# Altium project edison_breakout.PrjPcb (part 2 of 2)

## Sheet usb_uart.SchDoc: Edison Gateway - Serial
size Letter; Author: Ye-Sheng Kuo; DocumentNumber: 7; Revision: 3; SheetNumber: 7; SheetTotal: 10
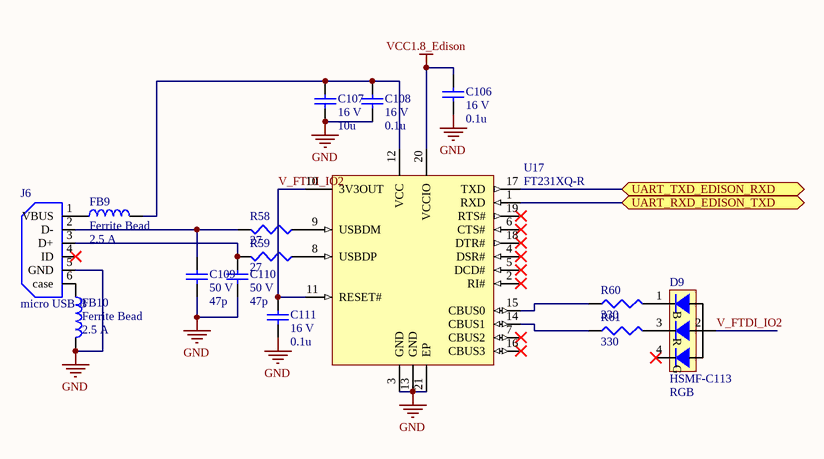
[diagram p7: usb_uart.SchDoc]

### Parts
C106  voltage rated: 16 V  [0402]  (hidden comment: 0.1u)
C107  voltage rated: 16 V  [0603]  (hidden comment: 10u)
C108  voltage rated: 16 V  [0402]  (hidden comment: 0.1u)
C109  voltage rated: 50 V  [0402]  (hidden comment: 47p)
C110  voltage rated: 50 V  [0402]  (hidden comment: 47p)
C111  voltage rated: 16 V  [0402]  (hidden comment: 0.1u)
D9  HSMF-C113  value RGB  [HSMF]
FB9  Ferrite Bead  Current Rating (Max): 2.5 A  [0603]
FB10  Ferrite Bead  Current Rating (Max): 2.5 A  [0603]
J6  micro USB-B  [Micro USB-B]
R58  27  [0402]
R59  27  [0402]
R60  330  [0402]
R61  330  [0402]
U17  FT231XQ-R  [QFN-20_N]

### Ports
UART_RXD_EDISON_TXD, UART_TXD_EDISON_RXD

### Nets
GND: C106.2 C107.2 C108.2 C109.2 C110.2 C111.2 FB10.1 J6.5(GND) U17.3(GND) U17.13(GND) U17.21(EP)
VCC1.8_Edison: C106.1 U17.20(VCCIO)
Edison_Serial_RX: U17.17(TXD) ; port UART_TXD_EDISON_RXD
Edison_Serial_TX: U17.1(RXD) ; port UART_RXD_EDISON_TXD
V_FTDI_IO2: C111.1 D9.2 U17.10(3V3OUT) U17.11(RESET#)
NetC107_1: C107.1 C108.1 FB9.1 U17.12(VCC)
NetC109_1: C109.1 J6.2(D-) R58.1
NetC110_1: C110.1 J6.3(D+) R59.1
NetD9_1: D9.1 R60.1
NetD9_3: D9.3 R61.1
NetFB9_2: FB9.2 J6.1(VBUS)
NetFB10_2: FB10.2 J6.6(case)
NetR58_2: R58.2 U17.9(USBDM)
NetR59_2: R59.2 U17.8(USBDP)
NetR60_2: R60.2 U17.15(CBUS0)
NetR61_2: R61.2 U17.14(CBUS1)

Not connected (* = marked no-connect by the designer): D9 4*; J6 4(ID)*; U17 2(RI#)* 4(DSR#)* 5(DCD#)* 6(CTS#)* 7(CBUS2)* 16(CBUS3)* 18(DTR#)* 19(RTS#)*

### Notes on the sheet
- Title
- Date:
- Author:
- Revision:
- Sheet
- of
- University of Michigan
- File:
- (in symbol HSMF-C113) B; R; G

### Library data of the parts
C106 C108 C111 = GRM155R71C104KA88D: 0.10µF ±10% 16V Ceramic Capacitor X7R 0402; Manufacture: Murata; tolerance: 10%; package: 0402; Supplier 1: Digi-Key; Supplier Part Number 1: 490-3261-1-ND; Value: 0.1u; Temperature Coefficient: X7R; Manufacturer Part Number: GRM155R71C104KA88D
C107 = GRM188C81C106MA73D: 10µF ±20% 16V Ceramic Capacitor X6S 0603; Manufacture: Murata; tolerance: 20%; package: 0603; Temperature Coefficient: X6S; Supplier 1: Digi-Key; Supplier Part Number 1: 490-7198-1-ND; Value: 10u; Manufacturer Part Number: GRM188C81C106MA73D
C109 C110 = 500R07N470JV4T: 47pF ±5% 50V Ceramic Capacitor C0G, NP0 0402; Manufacture: Johanson Dielectrics Inc.; tolerance: 5%; package: 0402; Supplier 1: Digi-Key; Supplier Part Number 1: 709-1121-1-ND; Value: 47p; Temperature Coefficient: C0G, NP0; Manufacturer Part Number: 500R07N470JV4T
D9 = HSMF-C113: Red, Green, Blue (RGB) 626nm Red, 572nm Green, 470nm Blue LED Indication - Discrete 1.9V Red, 2V Green, 3.4V Blue 4-SMD; Manufacturer: Broadcom Limited; Supplier 1: Digi-Key; Supplier Part Number 1: 516-2232-1-ND; Manufacturer Part Number: HSMF-C113; Wavelength: 626nm Red, 572nm Green, 470nm Blue
FB9 FB10 = BLM18SG221TN1D: FERRITE BEAD 220 OHM 0603; Manufacturer: Murata; DC resistance: 40m; Impedance @ Frequency: 220 Ohm @ 100MHz; package: 0603; Supplier 1: Digi-Key; Supplier Part Number 1: 490-5225-1-ND; Manufacturer Part Number: BLM18SG221TN1D
J6 = Micro USB: CONN USB MICRO B RECPT SMT R/A; Supplier 1: Digi-Key; Supplier Part Number 1: 609-4616-1-ND
R58 R59 = CRCW040227R0FKED: RES SMD 27 OHM 1% 1/16W 0402; Manufacturer: Vishay Dale; Temperature Coefficient: 100 ppm/C; Tolerance: 1%; Power: 1/16 W; package: 0402; Supplier 1: Digi-Key; Supplier Part Number 1: 541-27.0LCT-ND; value: 27; Manufacturer Part Number: CRCW040227R0FKED
R60 R61 = CRCW0402330RFKED: RES SMD 330 OHM 1% 1/16W 0402; Manufacturer: Vishay Dale; Temperature Coefficient: 100 ppm/C; Tolerance: 1%; Power: 1/16 W; package: 0402; Supplier 1: Digi-Key; Supplier Part Number 1: 541-330LCT-ND; value: 330; Manufacturer Part Number: CRCW0402330RFKED
U17 = FT231XQ-R: USB to Full-Handshake UART Interface Chip, UHCI/OHCI/EHCI Compatible, USB 2.0 Compatible, -40 to +85 degC, 20-Pin QFN, Pb-Free, Tape and Reel; Manufacturer: FTDI; DatasheetVersion: ver 1.2, Feb-2013; PackageVersion: Feb-13; PackageReference: QFN-20; PackageDescription: 20-Pin Quad Flat No-Lead, 4 x 4 mm Body, 0.5 mm Pitch; Code_JEDEC: MO-220WGGD-1; PartNumber: FT231XQ-R; ComponentLink1Description: Manufacturer URL; ComponentLink1URL: http://www.ftdichip.com/; ComponentLink2Description: Datasheet; ComponentLink2URL: http://www.ftdichip.com/Support/Documents/DataSheets/ICs/DS_FT231X.pdf; ComponentLink3Description: FT231X Product Page; ComponentLink3URL: www.ftdichip.com/Products/ICs/FT231X.html; Supplier 1: Digi-Key; Supplier Part Number 1: 768-1155-ND

## Sheet cc2520_cc2592.SchDoc: Edison Gateway - CC2520
size Letter; Author: Ye-Sheng Kuo; DocumentNumber: 9; Revision: 3; SheetNumber: 9; SheetTotal: 10
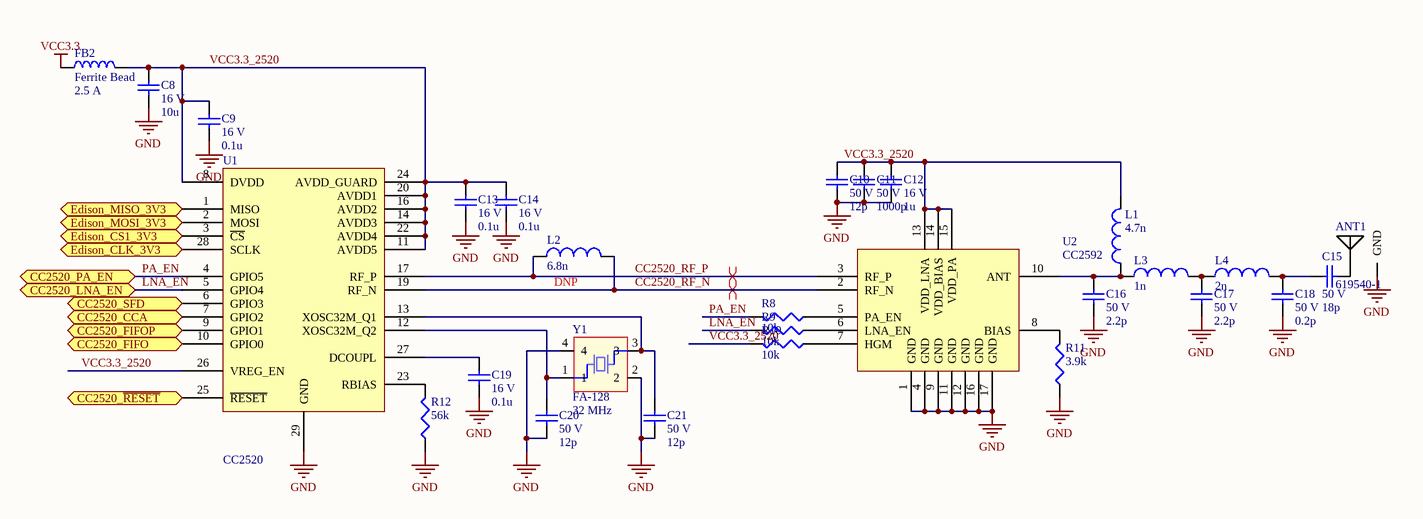
[diagram p8: cc2520_cc2592.SchDoc]

### Parts
ANT1  619540-1  [619540-1]
C8  voltage rated: 16 V  [0603]  (hidden comment: 10u)
C9  voltage rated: 16 V  [0402]  (hidden comment: 0.1u)
C10  voltage rated: 50 V  [0402]  (hidden comment: 12p)
C11  voltage rated: 50 V  [0402]  (hidden comment: 1000p)
C12  voltage rated: 16 V  [0402]  (hidden comment: 1u)
C13  voltage rated: 16 V  [0402]  (hidden comment: 0.1u)
C14  voltage rated: 16 V  [0402]  (hidden comment: 0.1u)
C15  voltage rated: 50 V  [0402]  (hidden comment: 18p)
C16  voltage rated: 50 V  [0402]  (hidden comment: 2.2p)
C17  voltage rated: 50 V  [0402]  (hidden comment: 2.2p)
C18  voltage rated: 50 V  [0402]  (hidden comment: 0.2p)
C19  voltage rated: 16 V  [0402]  (hidden comment: 0.1u)
C20  voltage rated: 50 V  [0402]  (hidden comment: 12p)
C21  voltage rated: 50 V  [0402]  (hidden comment: 12p)
FB2  Ferrite Bead  Current Rating (Max): 2.5 A  [0603]
L1  4.7n  [0402]
L2  Note: DNP  [0402]  (hidden comment: 6.8n)
L3  1n  [0402]
L4  2n  [0402]
R8  10k  [0402]
R9  10k  [0402]
R10  10k  [0402]
R11  3.9k  [0402]
R12  56k  [0402]
U1  CC2520  [QFN-28]
U2  CC2592  [QFN-16]
Y1  FA-128  frequency: 32 MHz  [FA-128]

### Ports
CC2520_CCA, CC2520_FIFO, CC2520_FIFOP, CC2520_LNA_EN, CC2520_PA_EN, CC2520_SFD, CC2520_~{RESET}, Edison_CLK_3V3, Edison_CS1_3V3, Edison_MISO_3V3, Edison_MOSI_3V3

### Nets
GND: ANT1.1(GND) C8.2 C9.2 C10.2 C11.2 C12.2 C13.2 C14.2 C16.2 C17.2 C18.2 C19.2 C20.1 C21.1 R11.2 R12.2 U1.29(GND) U2.1(GND) U2.4(GND) U2.9(GND) U2.11(GND) U2.12(GND) U2.16(GND) U2.17(GND) Y1.2 Y1.4
VCC3.3: FB2.2
CC2520_RF_N: L2.1 U1.19(RF_N) U2.2(RF_N)
CC2520_RF_P: L2.2 U1.17(RF_P) U2.3(RF_P)
Edison_CLK_3V3: U1.28(SCLK) ; port Edison_CLK_3V3
Edison_CS1_3V3: U1.3(~{CS}) ; port Edison_CS1_3V3
Edison_GP14_3V3: U1.9(GPIO1) ; port CC2520_FIFOP
Edison_GP19_3V3: U1.25(~{RESET}) ; port CC2520_~{RESET}
Edison_GP20_3V3: U1.10(GPIO0) ; port CC2520_FIFO
Edison_GP48_3V3: U1.6(GPIO3) ; port CC2520_SFD
Edison_GP49_3V3: U1.7(GPIO2) ; port CC2520_CCA
Edison_MISO_3V3: U1.1(MISO) ; port Edison_MISO_3V3
Edison_MOSI_3V3: U1.2(MOSI) ; port Edison_MOSI_3V3
LNA_EN: R9.1 U1.5(GPIO4) ; port CC2520_LNA_EN  [project net Edison_GP47_3V3]
PA_EN: R8.1 U1.4(GPIO5) ; port CC2520_PA_EN  [project net Edison_GP183_3V3]
VCC3.3_2520: C8.1 C9.1 C10.1 C11.1 C12.1 C13.1 C14.1 FB2.1 L1.1 R10.1 U1.8(DVDD) U1.11(AVDD5) U1.14(AVDD3) U1.16(AVDD2) U1.20(AVDD1) U1.22(AVDD4) U1.24(AVDD_GUARD) U1.26(VREG_EN) U2.13(VDD_LNA) U2.14(VDD_BIAS) U2.15(VDD_PA)
NetANT1_2: ANT1.2 C15.2
NetC15_1: C15.1 C18.1 L4.1
NetC16_1: C16.1 L1.2 L3.2 U2.10(ANT)
NetC17_1: C17.1 L3.1 L4.2
NetC19_1: C19.1 U1.27(DCOUPL)
NetC20_2: C20.2 U1.12(XOSC32M_Q2) Y1.1
NetC21_2: C21.2 U1.13(XOSC32M_Q1) Y1.3
NetR8_2: R8.2 U2.5(PA_EN)
NetR9_2: R9.2 U2.6(LNA_EN)
NetR10_2: R10.2 U2.7(HGM)
NetR11_1: R11.1 U2.8(BIAS)
NetR12_1: R12.1 U1.23(RBIAS)

### Layout directives
differential pair: CC2520_RF_N, CC2520_RF_P

### Notes on the sheet
- Title
- Date:
- Author:
- Revision:
- Sheet
- of
- University of Michigan
- File:

### Library data of the parts
ANT1 = 619540-1: CONN SMA JACK; Supplier 1: Digi-Key; Supplier Part Number 1: A120734-ND
C8 = GRM188C81C106MA73D: as C107 on sheet usb_uart; tolerance: 20%; package: 0603; Temperature Coefficient: X6S; Supplier 1: Digi-Key; Supplier Part Number 1: 490-7198-1-ND; Value: 10u; Manufacturer Part Number: GRM188C81C106MA73D
C9 C13 C14 C19 = GRM155R71C104KA88D: as C106 on sheet usb_uart; tolerance: 10%; package: 0402; Supplier 1: Digi-Key; Supplier Part Number 1: 490-3261-1-ND; Value: 0.1u; Temperature Coefficient: X7R; Manufacturer Part Number: GRM155R71C104KA88D
C10 C20 C21 = 500R07S120GV4T: 12pF ±2% 50V Ceramic Capacitor C0G, NP0 0402; Manufacture: Johanson Technology Inc.; Note: RF application; tolerance: 2%; package: 0402; Supplier 1: Digi-Key; Supplier Part Number 1: 712-1256-1-ND; Value: 12p; Temperature Coefficient: C0G, NP0; Manufacturer Part Number: 500R07S120GV4T
C11 = C1005C0G1H102J050BA: 1000pF ±5% 50V Ceramic Capacitor C0G, NP0 0402; Manufacture: TDK; tolerance: 5%; package: 0402; Supplier 1: Digi-Key; Supplier Part Number 1: 445-6846-1-ND; Value: 1000p; Temperature Coefficient: C0G, NP0; Manufacturer Part Number: C1005C0G1H102J050BA
C12 = C1005X6S1C105K050BC: 1µF ±10% 16V Ceramic Capacitor X6S 0402; Manufacture: TDK; tolerance: 10%; package: 0402; Supplier 1: Digi-Key; Supplier Part Number 1: 445-9086-1-ND; Value: 1u; Temperature Coefficient: X6S; Manufacturer Part Number: C1005X6S1C105K050BC
C15 = 500R07S180GV4T: 18pF ±2% 50V Ceramic Capacitor C0G, NP0 0402; Manufacture: Johanson Technology Inc.; Note: RF application; tolerance: 2%; package: 0402; Temperature Coefficient: C0G, NP0; Supplier 1: Digi-Key; Supplier Part Number 1: 712-1264-1-ND; Value: 18p; Manufacturer Part Number: 500R07S180GV4T
C16 C17 = 500R07S2R2BV4T: 2.2pF ±0.1pF 50V Ceramic Capacitor C0G, NP0; Manufacture: Johanson Technology Inc.; tolerance: 0.1p; package: 0402; Temperature Coefficient: C0G, NP0; Supplier 1: Digi-Key; Supplier Part Number 1: 712-1279-1-ND; Value: 2.2p; Manufacturer Part Number: 500R07S2R2BV4T
C18 = 500R07S0R2AV4T: 0.20pF ±0.05pF 50V Ceramic Capacitor C0G, NP0 0402; Manufacture: Johanson Technology Inc.; tolerance: 0.05p; Note: RF application; package: 0402; Temperature Coefficient: C0G, NP0; Supplier 1: Digi-Key; Supplier Part Number 1: 712-1244-1-ND; Value: 0.2p; Manufacturer Part Number: 500R07S0R2AV4T
FB2 = BLM18SG221TN1D: as FB9 on sheet usb_uart; package: 0603; Supplier 1: Digi-Key; Supplier Part Number 1: 490-5225-1-ND; Manufacturer Part Number: BLM18SG221TN1D
L1 = LQG15HS4N7S02D: 4.7nH Unshielded Multilayer Inductor 300mA 180 mOhm Max 0402 (1005 Metric); Manufacturer: Murata; tolerance: 0.3n; DCR (Max): 180m; package: 0402; Current Rating: 300 mA; Supplier 1: Digi-Key; Supplier Part Number 1: 490-2618-1-ND; Value: 4.7n; Manufacturer Part Number: LQG15HS4N7S02D
L2 = L-07C6N8JV6T: 6.8nH Unshielded Multilayer Inductor 250mA 320 mOhm Max 0402 (1005 Metric); Manufacturer: Johanson Technology Inc.; tolerance: 5%; DCR (Max): 320m; package: 0402; Supplier 1: Digi-Key; Supplier Part Number 1: 712-1419-1-ND; Value: 6.8n; Current Rating: 250 mA; Manufacturer Part Number: L-07C6N8JV6T
L3 = LQG15HN1N0S02D: 1nH Unshielded Multilayer Inductor 300mA 100 mOhm Max 0402 (1005 Metric); Manufacturer: Murata; tolerance: 0.3n; DCR (Max): 100m; package: 0402; Current Rating: 300 mA; Supplier 1: Digi-Key; Supplier Part Number 1: 490-1073-1-ND; Value: 1n; Manufacturer Part Number: LQG15HN1N0S02D
L4 = LQG15HN2N0S02D: 2nH Unshielded Multilayer Inductor 300mA 120 mOhm Max 0402 (1005 Metric); Manufacturer: Murata; tolerance: 0.3n; DCR (Max): 120m; package: 0402; Current Rating: 300 mA; Supplier 1: Digi-Key; Supplier Part Number 1: 490-6558-1-ND; Value: 2n; Manufacturer Part Number: LQG15HN2N0S02D
R8-R10 = CRCW040210K0FKED: RES SMD 10K OHM 1% 1/16W 0402; Manufacturer: Vishay Dale; Temperature Coefficient: 100 ppm/C; Tolerance: 1%; Power: 1/16 W; package: 0402; Supplier 1: Digi-Key; Supplier Part Number 1: 541-10.0KLCT-ND; value: 10k; Manufacturer Part Number: CRCW040210K0FKED
R11 = RC0402FR-073K9L: RES SMD 3.9K OHM 1% 1/16W 0402; Manufacturer: Yageo; Temperature Coefficient: 100 ppm/C; Tolerance: 1%; Power: 1/16 W; package: 0402; Supplier 1: Digi-Key; Supplier Part Number 1: 311-3.90KLRCT-ND; value: 3.9k; Manufacturer Part Number: RC0402FR-073K9L
R12 = CRCW040256K0FKED: RES SMD 56K OHM 1% 1/16W 0402; Manufacturer: Vishay Dale; Temperature Coefficient: 100 ppm/C; Power: 1/16 W; package: 0402; Supplier 1: Digi-Key; Supplier Part Number 1: 541-56.0KLCT-ND; Tolerance: 1%; value: 56k; Manufacturer Part Number: CRCW040256K0FKED
U1 = CC2520: 2.4 GHZ IEEE 802.15.4/ZIGBEE® RF TRANSCEIVER; Supplier 1: Digi-Key; Supplier Part Number 1: 296-38897-1-ND
U2 = CC2592: 2.4-GHz Range Extender; Supplier 1: Digi-Key; Supplier Part Number 1: 296-37475-1-ND
Y1 = FA-128: MHz Range Crystal Unit; Load capatance: 10 pF; ESR: 60; stability: 20 ppm; Supplier 1: Digi-Key; Supplier Part Number 1: SER4079CT-ND

## Sheet cellular_modem.SchDoc: Edison Gateway - Cellular
size Letter; Author: Ye-Sheng Kuo; DocumentNumber: 10; Revision: 3; SheetNumber: 10; SheetTotal: 10
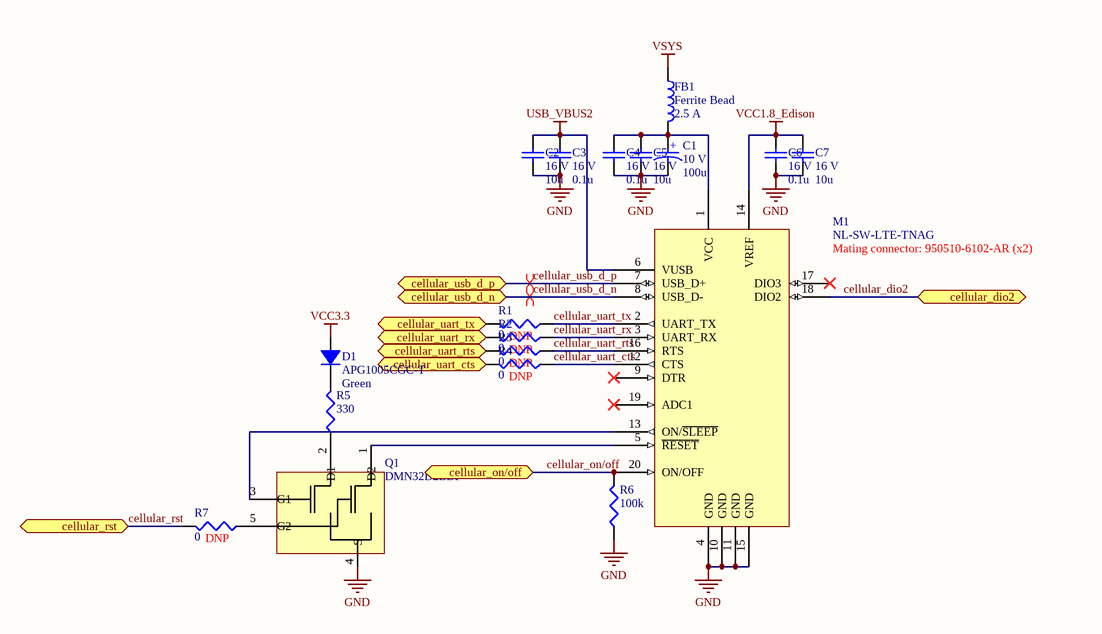
[diagram p9: cellular_modem.SchDoc]

### Parts
C1  voltage rated: 10 V  [1206 - POLAR MARKING]  (hidden comment: 100u)
C2  voltage rated: 16 V  [0603]  (hidden comment: 10u)
C3  voltage rated: 16 V  [0402]  (hidden comment: 0.1u)
C4  voltage rated: 16 V  [0402]  (hidden comment: 0.1u)
C5  voltage rated: 16 V  [0603]  (hidden comment: 10u)
C6  voltage rated: 16 V  [0402]  (hidden comment: 0.1u)
C7  voltage rated: 16 V  [0603]  (hidden comment: 10u)
D1  APG1005CGC-T  value Green  [0402 - LED]
FB1  Ferrite Bead  Current Rating (Max): 2.5 A  [0603]
M1  NL-SW-LTE-TNAG  Note: Mating connector: 950510-6102-AR (x2)  [skywire]
Q1  DMN32D2LDF  [SOT-353-5]
R1  Note: DNP  [0402]  (hidden comment: 0)
R2  Note: DNP  [0402]  (hidden comment: 0)
R3  Note: DNP  [0402]  (hidden comment: 0)
R4  Note: DNP  [0402]  (hidden comment: 0)
R5  330  [0402]
R6  100k  [0402]
R7  Note: DNP  [0402]  (hidden comment: 0)

### Ports
cellular_dio2, cellular_on/off, cellular_rst, cellular_uart_cts, cellular_uart_rts, cellular_uart_rx, cellular_uart_tx, cellular_usb_d_n, cellular_usb_d_p

### Nets
GND: C1.2 C2.2 C3.2 C4.2 C5.2 C6.2 C7.2 M1.4(GND) M1.10(GND) M1.11(GND) M1.15(GND) Q1.4(S) R6.2
USB_VBUS2: C2.1 C3.1 M1.6(VUSB)
VCC1.8_Edison: C6.1 C7.1 M1.14(VREF)
VCC3.3: D1.1
VSYS: FB1.2
cellular_dio2: M1.18(DIO2) ; port cellular_dio2
cellular_on/off: M1.20(ON/OFF) R6.1 ; port cellular_on/off
cellular_rst: R7.1 ; port cellular_rst
cellular_uart_cts: M1.12(CTS) R4.2
cellular_uart_rts: M1.16(RTS) R3.2
cellular_uart_rx: M1.3(UART_RX) R2.2
cellular_uart_tx: M1.2(UART_TX) R1.2
cellular_usb_d_n: M1.8(USB_D-) ; port cellular_usb_d_n
cellular_usb_d_p: M1.7(USB_D+) ; port cellular_usb_d_p
Edison_UART_CTS: R4.1 ; port cellular_uart_cts
Edison_UART_RTS: R3.1 ; port cellular_uart_rts
Edison_UART_RX: R1.1 ; port cellular_uart_tx
Edison_UART_TX: R2.1 ; port cellular_uart_rx
NetC1_1: C1.1 C4.1 C5.1 FB1.1 M1.1(VCC)
NetD1_2: D1.2 R5.1
NetM1_5: M1.5(~{RESET}) Q1.1(D2)
NetM1_13: M1.13(ON/~{SLEEP}) Q1.3(G1)
NetQ1_2: Q1.2(D1) R5.2
NetQ1_5: Q1.5(G2) R7.2

Not connected (* = marked no-connect by the designer): M1 9(DTR)* 17(DIO3)* 19(ADC1)*

### Layout directives
differential pair: cellular_usb_d_n, cellular_usb_d_p

### Notes on the sheet
- Title
- Date:
- Author:
- Revision:
- Sheet
- of
- University of Michigan
- File:
- (in symbol TLNK107M010R2500) +

### Library data of the parts
C1 = TLNK107M010R2500: 100µF ±20% Molded Tantalum Capacitors 10V 1206; Manufacture: AVX; ESR: 2.5 Ohm; tolerance: 20%; package: 1206; Supplier 1: Digi-Key; Supplier Part Number 1: 478-6251-1-ND; Value: 100u; Manufacturer Part Number: TLNK107M010R2500
C2 C5 C7 = GRM188C81C106MA73D: as C107 on sheet usb_uart; tolerance: 20%; package: 0603; Temperature Coefficient: X6S; Supplier 1: Digi-Key; Supplier Part Number 1: 490-7198-1-ND; Value: 10u; Manufacturer Part Number: GRM188C81C106MA73D
C3 C4 C6 = GRM155R71C104KA88D: as C106 on sheet usb_uart; tolerance: 10%; package: 0402; Supplier 1: Digi-Key; Supplier Part Number 1: 490-3261-1-ND; Value: 0.1u; Temperature Coefficient: X7R; Manufacturer Part Number: GRM155R71C104KA88D
D1 = APG1005CGC-T: Green 571nm LED Indication - Discrete 2V 0402 (1005 Metric); Manufacturer: Kingbright; Current @ VF: 20 mA; package: 0402; Forward Voltage: 2 V; Manufacturer Part Number: APG1005CGC-T; Wavelength: 571 nm; Supplier 1: Digi-Key; Supplier Part Number 1: 754-1811-1-ND
FB1 = BLM18SG221TN1D: as FB9 on sheet usb_uart; package: 0603; Supplier 1: Digi-Key; Supplier Part Number 1: 490-5225-1-ND; Manufacturer Part Number: BLM18SG221TN1D
M1 = NL-SW-LTE-TNAG: NimbeLink Skywire cat3, ATT GSM 4G modem
Q1 = DMN32D2LDF: Common Source Dual N-Channel MOSFET; Supplier 1: Digi-Key; Supplier Part Number 1: DMN32D2LDF-7DICT-ND
R1-R4 R7 = CRCW04020000Z0EDHP: RES SMD 0.0 OHM JUMPER 1/5W 0402; Manufacturer: Vishay Dale; Temperature Coefficient: NA; package: 0402; Supplier 1: Digi-Key; Supplier Part Number 1: 541-0.0YBCT-ND; value: 0; Manufacturer Part Number: CRCW04020000Z0EDHP; Power: 1/5 W; Tolerance: NA
R5 = CRCW0402330RFKED: as R60 on sheet usb_uart; Tolerance: 1%; Power: 1/16 W; package: 0402; Supplier 1: Digi-Key; Supplier Part Number 1: 541-330LCT-ND; value: 330; Manufacturer Part Number: CRCW0402330RFKED
R6 = CRCW0402100KFKED: RES SMD 100K OHM 1% 1/16W 0402; Manufacturer: Vishay Dale; Temperature Coefficient: 100 ppm/C; Tolerance: 1%; Power: 1/16 W; Supplier 1: Digi-Key; Supplier Part Number 1: 541-100KLCT-ND; package: 0402; value: 100k; Manufacturer Part Number: CRCW0402100KFKED

## Sheet antennas.SchDoc
size Letter; Author: Ye-Sheng Kuo; Organization: Altium Limited; Address1: L3, 12a Rodborough Rd; Address2: Frenchs Forest; Address3: NSW; Address4: Australia 2086; Revision: 1
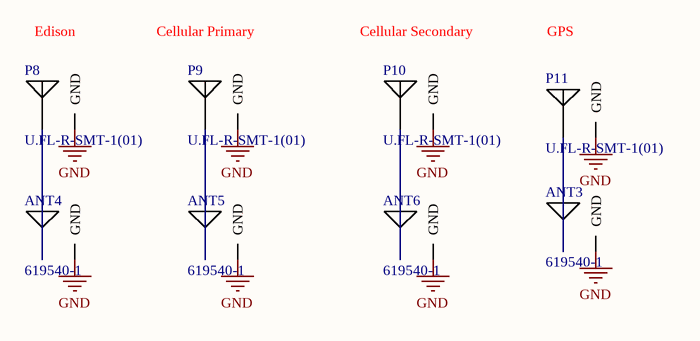
[diagram p10: antennas.SchDoc]

### Parts
ANT3  619540-1  [619540-1]
ANT4  619540-1  [619540-1]
ANT5  619540-1  [619540-1]
ANT6  619540-1  [619540-1]
P8  U.FL-R-SMT-1(01)  [U.FL-R-SMT-1(01)]
P9  U.FL-R-SMT-1(01)  [U.FL-R-SMT-1(01)]
P10  U.FL-R-SMT-1(01)  [U.FL-R-SMT-1(01)]
P11  U.FL-R-SMT-1(01)  [U.FL-R-SMT-1(01)]

### Nets
GND: ANT3.1(GND) ANT4.1(GND) ANT5.1(GND) ANT6.1(GND) P8.1(GND) P9.1(GND) P10.1(GND) P11.1(GND)
NetANT3_2: ANT3.2 P11.2
NetANT4_2: ANT4.2 P8.2
NetANT5_2: ANT5.2 P9.2
NetANT6_2: ANT6.2 P10.2

### Notes on the sheet
- Edison
- Cellular Primary
- Cellular Secondary
- GPS
- Title
- Date:
- Author:
- Revision:
- Sheet
- of
- University of Michigan
- File:

### Library data of the parts
ANT3-ANT6 = 619540-1: CONN SMA JACK; Supplier 1: Digi-Key; Supplier Part Number 1: A120734-ND
P8-P11 = U.FL-R-SMT-1(01): U.FL, Ultra Miniature Coaxial Connector Receptacle, Male Pin 50 Ohm Surface Mount Solder; Supplier 1: Digi-Key; Supplier Part Number 1: H122041-ND

## Nets that join several sheets
GND: cc2538 (30 pins), edison_gpio (33 pins), edison_misc (SW3.3 SW3.4), ethernet (16 pins), power (65 pins), usb_host_slave (32 pins), usb_uart (11 pins), cc2520_cc2592 (26 pins), cellular_modem (13 pins), antennas (8 pins)
USB_VBUS2: usb_host_slave (C98.1 C100.1 C101.1 U15.7), cellular_modem (C2.1 C3.1 M1.6)
USB_VBUS3: cc2538 (Q2.4 R13.1), usb_host_slave (C104.1 C105.1 U15.6)
VCC1.8_Edison: edison_gpio (13 pins), power (M2.12), usb_uart (C106.1 U17.20), cellular_modem (C6.1 C7.1 M1.14)
VCC3.3: cc2538 (D2.2 R14.1 R15.1), edison_gpio (14 pins), edison_misc (R35.1), ethernet (8 pins), power (36 pins), usb_host_slave (5 pins), cc2520_cc2592 (FB2.2), cellular_modem (D1.1)
VCC3.3A: ethernet (7 pins), power (15 pins)
VEXT_IN: power (12 pins), usb_host_slave (7 pins)
VSYS: edison_gpio (P3.2), power (8 pins), cellular_modem (FB1.2)
CC2538_PA3: cc2538 (U3.19), edison_gpio (P3.5)
CC2538_PA4: cc2538 (U3.20), edison_gpio (P3.3)
CC2538_PA5: cc2538 (U3.21), edison_gpio (P3.4)
cellular_dio2: edison_gpio (M2.24), cellular_modem (M1.18)
cellular_on/off: edison_gpio (M2.52), cellular_modem (M1.20 R6.1)
cellular_rst: edison_gpio (M2.42), cellular_modem (R7.1)
cellular_usb_d_n: usb_host_slave (U10.1), cellular_modem (M1.8)
cellular_usb_d_p: usb_host_slave (U10.2), cellular_modem (M1.7)
Edison_CLK_3V3: cc2538 (U3.11), edison_gpio (P3.14 U7.16), cc2520_cc2592 (U1.28)
Edison_CS0_3V3: cc2538 (U3.12), edison_gpio (U7.15)
Edison_CS1_3V3: edison_gpio (P3.13 U7.14), cc2520_cc2592 (U1.3)
Edison_GP14_3V3: edison_gpio (U8.14), cc2520_cc2592 (U1.9)
Edison_GP19_3V3: edison_gpio (U6.18), cc2520_cc2592 (U1.25)
Edison_GP20_3V3: edison_gpio (U6.20), cc2520_cc2592 (U1.10)
Edison_GP41_3V3: cc2538 (U3.14), edison_gpio (U8.13)
Edison_GP43_3V3: cc2538 (U3.13), edison_gpio (U8.12)
Edison_GP45: cc2538 (Q3.5 R16.1), edison_gpio (M2.26)
Edison_GP47_3V3: edison_gpio (U8.18), cc2520_cc2592 (R9.1 U1.5)
Edison_GP48_3V3: edison_gpio (U8.17), cc2520_cc2592 (U1.6)
Edison_GP49_3V3: edison_gpio (U8.16), cc2520_cc2592 (U1.7)
Edison_GP183_3V3: edison_gpio (U6.17), cc2520_cc2592 (R8.1 U1.4)
Edison_MISO_3V3: cc2538 (U3.8), edison_gpio (P3.16 U7.18), cc2520_cc2592 (U1.1)
Edison_MOSI_3V3: cc2538 (U3.9), edison_gpio (P3.15 U7.17), cc2520_cc2592 (U1.2)
Edison_Serial_RX: edison_gpio (M2.22), usb_uart (U17.17)
Edison_Serial_TX: edison_gpio (M2.27), usb_uart (U17.1)
Edison_UART_CTS: edison_gpio (M2.65), cellular_modem (R4.1)
Edison_UART_RTS: edison_gpio (M2.63), cellular_modem (R3.1)
Edison_UART_RX: edison_gpio (M2.61 U7.1), cellular_modem (R1.1)
Edison_UART_TX: edison_gpio (M2.46 U8.6), cellular_modem (R2.1)
NetR36_1: cc2538 (U3.5), edison_misc (R36.1)
USB_FTDI_N: cc2538 (C27.2 R21.1), usb_host_slave (U10.3)
USB_FTDI_P: cc2538 (C28.2 R24.1), usb_host_slave (U10.4)